# EAGLE schematic counter (EAGLE 6.3)
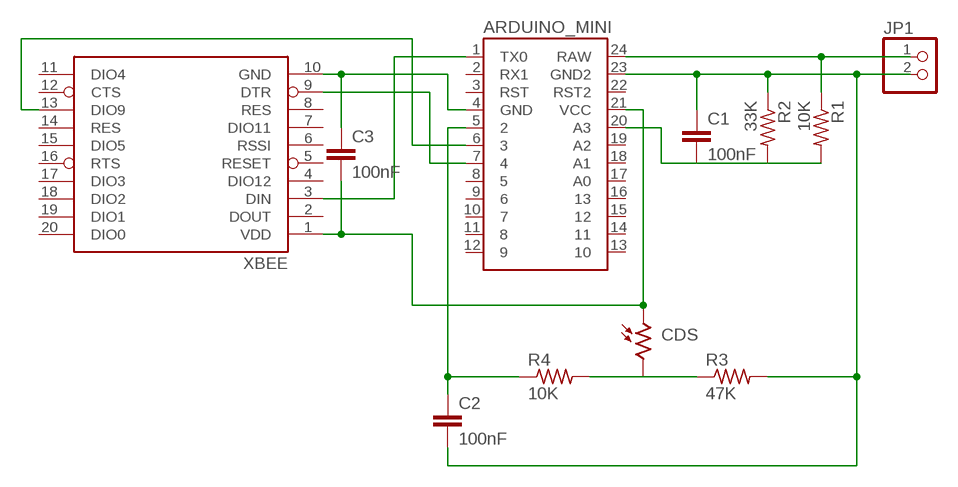
[diagram p0: schematic, sheet 1]

## Parts
ARDUINO_MINI  ARDUINO_MINI  [ARDUINO_MINI]
C1  100nF  C-EU050-024X044  [C050-024X044]
C2  100nF  C-EU050-024X044  [C050-024X044]
C3  100nF  C-EU050-024X044  [C050-024X044]
CDS  VT90N1  [VT900]
JP1  PINHD-1X2  [1X02]
R1  10K  R-US_0204/7  [0204/7]
R2  33K  R-US_0204/7  [0204/7]
R3  47K  R-US_0204/7  [0204/7]
R4  10K  R-US_0204/7  [0204/7]
XBEE  XBEE-1B1  [XBEE-1]

## Nets
N$1: CDS.2 R3.1 R4.2
N$2: ARDUINO_MINI.4(GND) C3.1 XBEE.10(GND)
N$3: ARDUINO_MINI.21(VCC) C3.2 CDS.1 XBEE.1(VDD)
N$4: ARDUINO_MINI.7 XBEE.9(DTR)
N$5: ARDUINO_MINI.24(RAW) JP1.1 R1.1
N$6: ARDUINO_MINI.23(GND2) C1.1 C2.2 JP1.2 R2.1 R3.2
N$7: ARDUINO_MINI.20(A3) C1.2 R1.2 R2.2
N$8: ARDUINO_MINI.5 C2.1 R4.1
N$9: ARDUINO_MINI.1(TX0) XBEE.3(DIN)
N$10: ARDUINO_MINI.6 XBEE.13(DIO9)
Unconnected: ARDUINO_MINI.2(RX1) ARDUINO_MINI.3(RST) ARDUINO_MINI.8 ARDUINO_MINI.9 ARDUINO_MINI.10 ARDUINO_MINI.11 ARDUINO_MINI.12 ARDUINO_MINI.13 ARDUINO_MINI.14 ARDUINO_MINI.15 ARDUINO_MINI.16 ARDUINO_MINI.17(A0) ARDUINO_MINI.18(A1) ARDUINO_MINI.19(A2) ARDUINO_MINI.22(RST2) XBEE.2(DOUT) XBEE.4(DIO12) XBEE.5(RESET) XBEE.6(RSSI) XBEE.7(DIO11) XBEE.8(RES) XBEE.11(DIO4) XBEE.12(CTS) XBEE.14(RES) XBEE.15(DIO5) XBEE.16(RTS) XBEE.17(DIO3) XBEE.18(DIO2) XBEE.19(DIO1) XBEE.20(DIO0)

## Library data of the parts
ARDUINO_MINI = SparkFun-Boards:ARDUINO_MINI: Arduino Pro Mini footprint
C1-C3 = resistor:C-EU: CAPACITOR, European symbol
CDS = photo-elements:VT9: Photoconductive Cell VT900 Series Source: http://optoelectronics.perkinelmer.com/content/Datasheets/DTS_vt900seriesdatasheet.pdf
JP1 = pinhead:PINHD-1X2: PIN HEADER
R1-R4 = resistor:R-US_: RESISTOR, American symbol
XBEE = SparkFun-RF:XBEE-1: Xbee module footprints SMT header is CONN-09042.